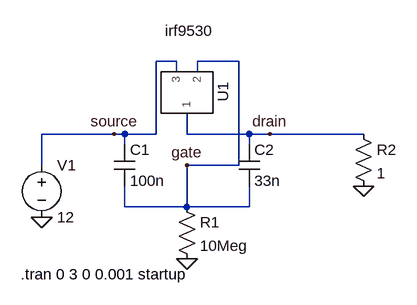
[diagram p0: schematic Soft start circuit.asc]
Soft start circuit.asc, the LTspice schematic file:
Version 4
SHEET 1 880 680
WIRE 192 -48 160 -48
WIRE 288 -48 224 -48
WIRE 192 -32 192 -48
WIRE 224 -32 224 -48
WIRE 96 64 -16 64
WIRE 112 64 96 64
WIRE 160 64 160 -48
WIRE 160 64 112 64
WIRE 208 64 208 32
WIRE 304 64 208 64
WIRE 336 64 304 64
WIRE 480 64 336 64
WIRE 112 80 112 64
WIRE 304 80 304 64
WIRE -16 112 -16 64
WIRE 288 112 288 -48
WIRE 288 112 208 112
WIRE 112 176 112 144
WIRE 208 176 208 112
WIRE 208 176 112 176
WIRE 304 176 304 144
WIRE 304 176 208 176
FLAG -16 192 0
FLAG 208 256 0
FLAG 480 144 0
FLAG 336 64 drain
FLAG 96 64 source
FLAG 208 112 gate
SYMBOL voltage -16 96 R0
WINDOW 123 0 0 Left 0
WINDOW 39 0 0 Left 0
SYMATTR InstName V1
SYMATTR Value 12
SYMBOL cap 96 80 R0
SYMATTR InstName C1
SYMATTR Value 100n
SYMBOL cap 288 80 R0
SYMATTR InstName C2
SYMATTR Value 33n
SYMBOL res 192 160 R0
SYMATTR InstName R1
SYMATTR Value 10Meg
SYMBOL res 464 48 R0
SYMATTR InstName R2
SYMATTR Value 1
SYMBOL irf9530 208 0 M270
WINDOW 3 79 -3 VTop 2
SYMATTR InstName U1
TEXT -48 280 Left 2 !.tran 0 3 0 0.001 startup

The netlist it stands for:
* Soft start circuit.asc
V1 source 0 12
C1 source gate 100n
C2 drain gate 33n
R1 gate 0 10Meg
R2 drain 0 1
XU1 drain gate source irf9530  ; pins 1 2 3
.tran 0 3 0 0.001 startup
.lib C:\Users\User\OneDrive - UNSW\Documents\LTspice\RadiatorFanSoftStart\sihf9530.lib
.backanno
.end

* Results of the author's LTspice run, read from the files saved beside the schematic
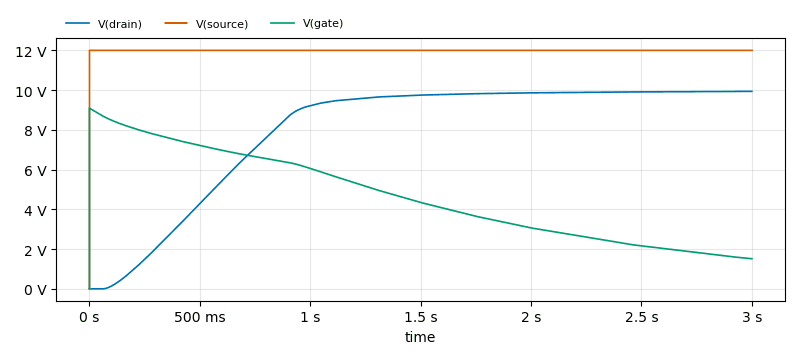
[diagram p1: Transient Analysis of Soft start circuit.asc, plotted from the saved traces]
* Transient Analysis, 1 run:
*   V(drain): min -65.14 µV, max 9.936 V, average 7.978 V, rms 8.571 V, last 9.936 V
*   V(source): min 0 V, max 12 V, average 12 V, rms 12 V, last 12 V
*   V(gate): min 0 V, max 9.093 V, average 4.655 V, rms 5.159 V, last 1.513 V